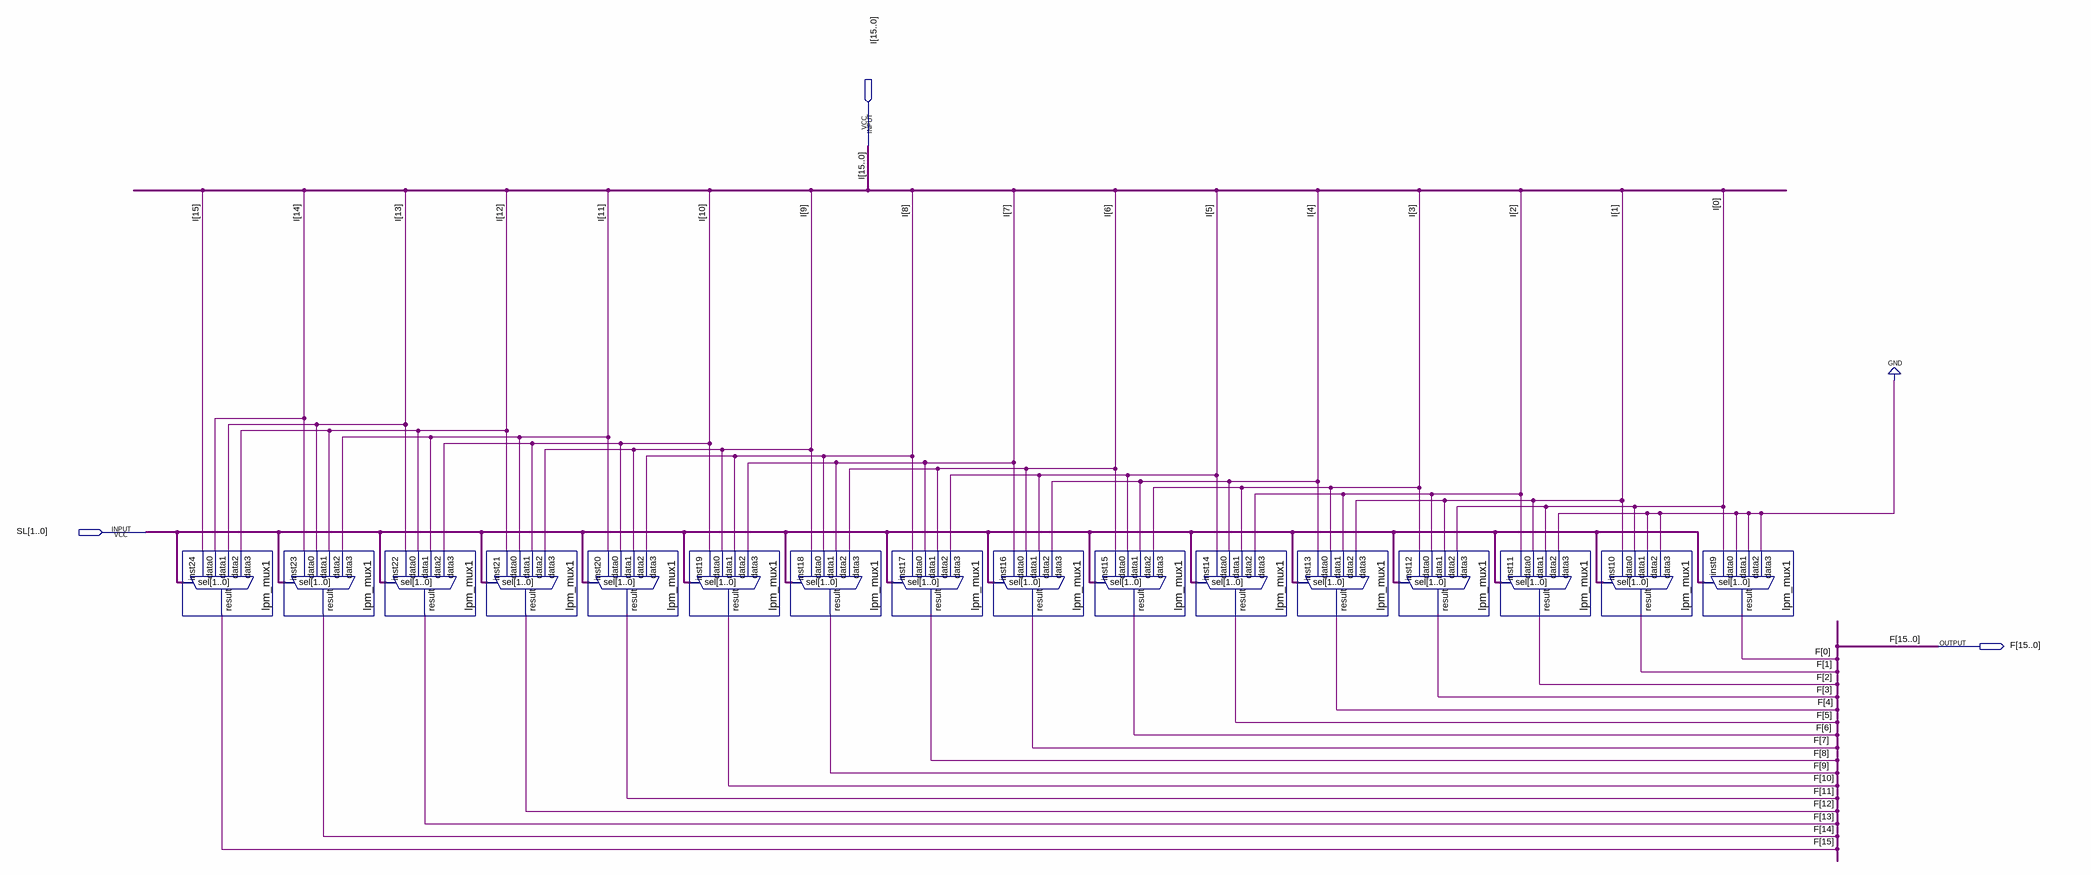
[diagram p0: schematic sheet]
// Quartus schematic ShiftL.bdf as structural Verilog: 16 symbols, 3 pins
module ShiftL (
  input  [15:0] I,
  input  [1:0] SL,
  output [15:0] F
);

  lpm_mux1 inst24 (.data3(I[12]), .data2(I[13]), .data1(I[14]), .data0(I[15]), .sel(SL), .result(F[15]));
  lpm_mux1 inst23 (.data3(I[11]), .data2(I[12]), .data1(I[13]), .data0(I[14]), .sel(SL), .result(F[14]));
  lpm_mux1 inst22 (.data3(I[10]), .data2(I[11]), .data1(I[12]), .data0(I[13]), .sel(SL), .result(F[13]));
  lpm_mux1 inst21 (.data3(I[9]), .data2(I[10]), .data1(I[11]), .data0(I[12]), .sel(SL), .result(F[12]));
  lpm_mux1 inst20 (.data3(I[8]), .data2(I[9]), .data1(I[10]), .data0(I[11]), .sel(SL), .result(F[11]));
  lpm_mux1 inst19 (.data3(I[7]), .data2(I[8]), .data1(I[9]), .data0(I[10]), .sel(SL), .result(F[10]));
  lpm_mux1 inst18 (.data3(I[6]), .data2(I[7]), .data1(I[8]), .data0(I[9]), .sel(SL), .result(F[9]));
  lpm_mux1 inst17 (.data3(I[5]), .data2(I[6]), .data1(I[7]), .data0(I[8]), .sel(SL), .result(F[8]));
  lpm_mux1 inst16 (.data3(I[4]), .data2(I[5]), .data1(I[6]), .data0(I[7]), .sel(SL), .result(F[7]));
  lpm_mux1 inst15 (.data3(I[3]), .data2(I[4]), .data1(I[5]), .data0(I[6]), .sel(SL), .result(F[6]));
  lpm_mux1 inst14 (.data3(I[2]), .data2(I[3]), .data1(I[4]), .data0(I[5]), .sel(SL), .result(F[5]));
  lpm_mux1 inst13 (.data3(I[1]), .data2(I[2]), .data1(I[3]), .data0(I[4]), .sel(SL), .result(F[4]));
  lpm_mux1 inst12 (.data3(I[0]), .data2(I[1]), .data1(I[2]), .data0(I[3]), .sel(SL), .result(F[3]));
  lpm_mux1 inst11 (.data3(1'b0), .data2(I[0]), .data1(I[1]), .data0(I[2]), .sel(SL), .result(F[2]));
  lpm_mux1 inst10 (.data3(1'b0), .data2(1'b0), .data1(I[0]), .data0(I[1]), .sel(SL), .result(F[1]));
  lpm_mux1 inst9 (.data3(1'b0), .data2(1'b0), .data1(1'b0), .data0(I[0]), .sel(SL), .result(F[0]));
endmodule
